# EAGLE design TamaDroppy (EAGLE 9.6.2)
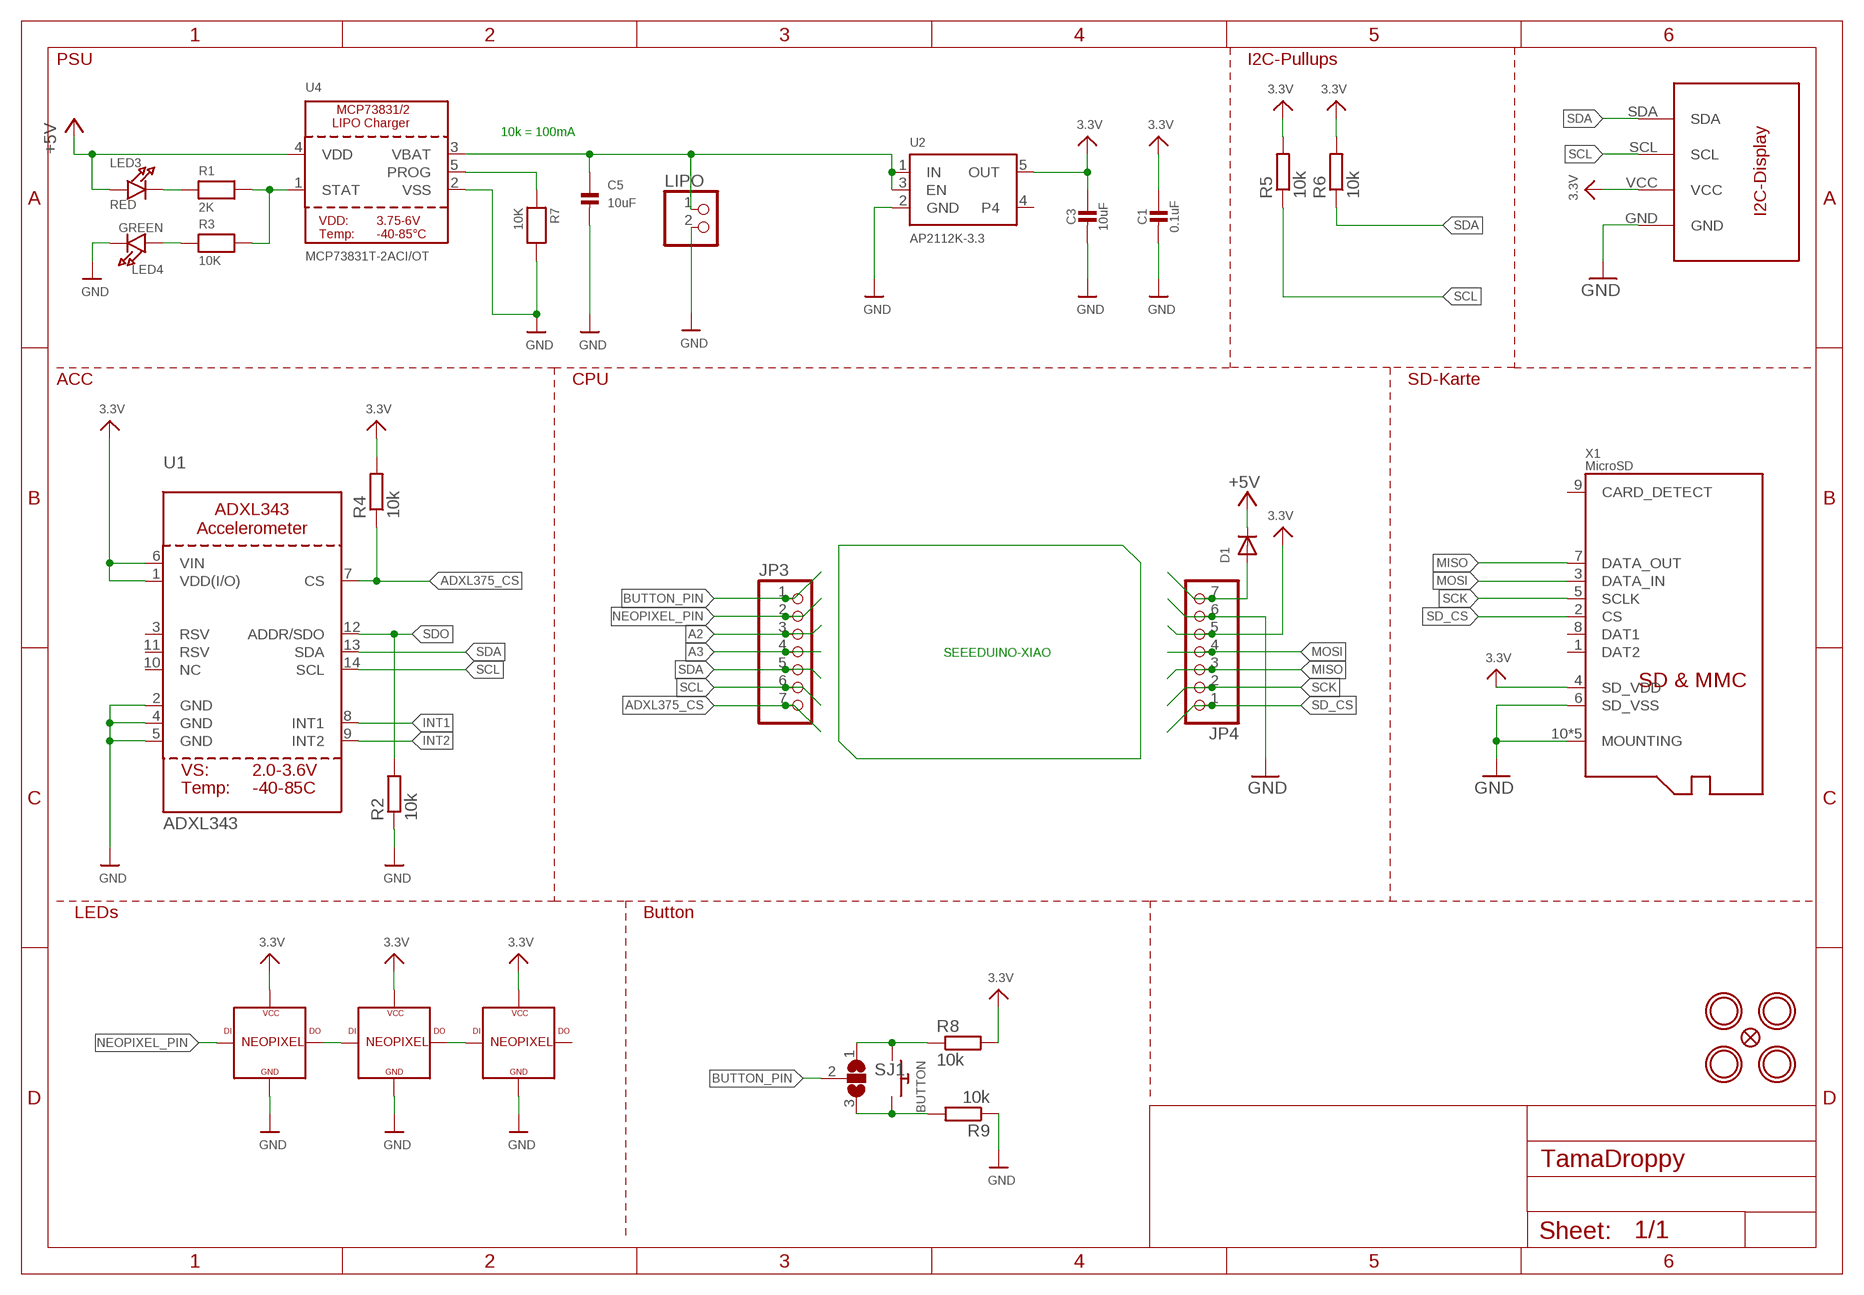
[diagram p0: schematic, sheet 1]

## Parts
BUTTON  SWITCH_PUSHBUTTONC&K_KSS  [BTN_CK_KSS]
C1  0.1uF  CAP_CERAMIC0603_NO  [0603-NO]
C3  10uF  CAP_CERAMIC0805-NOOUTLINE  [0805-NO]
C5  10uF  CAP_CERAMIC0805-NOOUTLINE  [0805-NO]
D1  DIODESOD-323F  [SOD-323F]
FID3  FIDUCIAL_1MM  [FIDUCIAL_1MM]
JP3  HEADER-1X7THICKER  [1X07_ROUND_76]
JP4  HEADER-1X7THICKER  [1X07_ROUND_76]
LED3  RED  LED0603_NOOUTLINE  [CHIPLED_0603_NOOUTLINE]
LED4  GREEN  LED0603_NOOUTLINE  [CHIPLED_0603_NOOUTLINE]
LIPO  PINHD-1X2  [1X02]
R1  2K  RESISTOR_0603_NOOUT  [0603-NO]
R2  10k  R-EU_M0805  [M0805]
R3  10K  RESISTOR_0603_NOOUT  [0603-NO]
R4  10k  R-EU_M0805  [M0805]
R5  10k  R-EU_M0805  [M0805]
R6  10k  R-EU_M0805  [M0805]
R7  10K  RESISTOR_0603_NOOUT  [0603-NO]
R8  10k  R-EU_M0805  [M0805]
R9  10k  R-EU_M0805  [M0805]
SJ1  SJ2W  [SJ_2]
U1  ADXL343  ACCEL_ADXL343  [LGA14]
U2  AP2112K-3.3  VREG_SOT23-5  [SOT23-5]
U4  MCP73831T-2ACI/OT  MCP73831/2  [SOT23-5]
U$2  MOUNTINGHOLE2.5  [MOUNTINGHOLE_2.5_PLATED]
U$16  EASTRISING_0.66  [EASTRISING_0.66]
U$17  MOUNTINGHOLE2.5  [MOUNTINGHOLE_2.5_PLATED]
U$19  MOUNTINGHOLE2.5  [MOUNTINGHOLE_2.5_PLATED]
U$21  MOUNTINGHOLE2.5  [MOUNTINGHOLE_2.5_PLATED]
U$31  WS2812_BOB  [WS2812B]
U$32  WS2812_BOB  [WS2812B]
U$33  WS2812_BOB  [WS2812B]
X1  MicroSD  MICROSD104031-0811  [MOLEX_104031-0811]

## Nets
3.3V [lowpower]: C1.1 C3.1 JP4.5 R4.2 R5.2 R6.2 R8.2 U1.1(VDD(I/O)) U1.6(VIN) U2.5(OUT) U$16.VCC U$31.VCC1(VCC) U$31.VCC2(VCC) U$32.VCC1(VCC) U$32.VCC2(VCC) U$33.VCC1(VCC) U$33.VCC2(VCC) X1.4(SD_VDD)
+5V [power]: D1.C LED3.A U4.4(VDD)
A2: JP3.3
A3: JP3.4
ADXL375_CS: JP3.7 R4.1 U1.7(CS)
BUTTON_PIN: JP3.1 SJ1.2
GND [power]: C1.2 C3.2 C5.2 JP4.6 LED4.C LIPO.2 R2.1 R7.2 R9.1 U1.2(GND) U1.4(GND) U1.5(GND) U2.2(GND) U4.2(VSS) U$16.GND U$31.GND1(GND) U$31.GND2(GND) U$32.GND1(GND) U$32.GND2(GND) U$33.GND1(GND) U$33.GND2(GND) X1.6(SD_VSS) X1.10(MOUNTING) X1.G1(MOUNTING) X1.G2(MOUNTING) X1.G3(MOUNTING) X1.G4(MOUNTING)
INT1: U1.8(INT1)
INT2: U1.9(INT2)
MISO: JP4.3 X1.7(DATA_OUT)
MOSI: JP4.4 X1.3(DATA_IN)
N$2: LED3.C R1.1
N$3: R1.2 R3.2 U4.1(STAT)
N$4: R7.1 U4.5(PROG)
N$5: D1.A JP4.7
N$6: LED4.A R3.1
N$7: BUTTON.P$1 R8.1 SJ1.1
N$8: BUTTON.P$2 R9.2 SJ1.3
N$9: U$31.DOUT(DO) U$32.DIN(DI)
N$10: U$32.DOUT(DO) U$33.DIN(DI)
NEOPIXEL_PIN: JP3.2 U$31.DIN(DI)
SCK: JP4.2 X1.5(SCLK)
SCL: JP3.6 R5.1 U1.14(SCL) U$16.SCL
SD_CS: JP4.1 X1.2(CS)
SDA: JP3.5 R6.1 U1.13(SDA) U$16.SDA
SDO: R2.2 U1.12(ADDR/SDO)
VBAT1: C5.1 LIPO.1 U2.1(IN) U2.3(EN) U4.3(VBAT)
Unconnected: U1.3(RSV) U1.10(NC) U1.11(RSV) U2.4 U$33.DOUT(DO) X1.1(DAT2) X1.8(DAT1) X1.9(CARD_DETECT)

## Notes on the sheet
- PSU | I2C-Pullups
- 10k = 100mA
- ACC | CPU | SD-Karte
- SEEEDUINO-XIAO
- LEDs | Button

## Library data of the parts
BUTTON = adafruit:SWITCH_PUSHBUTTON: Buttons SOFTTOUCHSMD_SJ - Soft touch temporary push button (Super Junk Akihabara) Compatible with SKPMANE010 [Mouser: 688-SKPMAN] C&K_KSS = Digikey: KSS221GLFS
C1 C3 C5 = microbuilder:CAP_CERAMIC: Ceramic Capacitors For new designs, use the packages preceded by an '_' character since they are more reliable: The following footprints should be used on most boards: _0402 - Standard footprint for regular board layouts _0603 - Standard footprint for regular board layouts _0805 - Standard footprint for regular board layouts _1206 - Standard footprint for regular board layouts For extremely tight-pitch boards where space is at a premium, the following 'micro-pitch' footprints can be used (smaller pads, no silkscreen outline, etc.): _0402MP - Micro-pitch footprint for very dense/compact boards _0603MP - Micro-pitch footprint for very dense/compact boards _0805MP - Micro-pitch footprint for very dense/compact boards _1206MP - Micro-pitch footprint for very dense/compact boards
D1 = adafruit:DIODE: Diode SMADIODE - SMA Surface Mount Package 20V 1A Schottky Diode Digikey: 641-1014-6-ND DO-1N4148 - Through Hole Small Current Diode SOD-123 20V 1 A (.5mV Vf) Schottky Diode - Digikey: MBRX120TPMSCT-ND SOD-323 10V 570mA (.38mV Vf, 3ns) Schottky Diode - Digikey: ZLLS410CT-ND SOD-523 30V 30mA Schottky Diode (RB751S-40TE61) - Digikey: RB751S-40TE61CT-ND SOT23-R/W - SOT23 Package (R = Solder Paste/Reflow Ovens, W = Hand-Soldering) BAT54Film 40V 300mA - Digikey: 497-7162-1-ND
FID3 = microbuilder:FIDUCIAL: Fiducial Alignment Points Various fiducial points for machine vision alignment.; BOM: EXCLUDE
JP3 JP4 = adafruit_electromech:HEADER-1X7: PIN HEADER
LED3 LED4 = microbuilder:LED: LED 0603 - 0603 Surface Mount Package 2mA: Green LED - Low Power (3.9mcd, 2ma, 1.7Vf) - Digikey: 475-2709-2-ND Orange LED - Low Power (9.8mcd, 2ma, 1.8Vf) - Digikey: 475-1194-2-ND Red LED - Low Power (5mcd, 2ma, 1.8Vf) - Digikey: 475-1195-2-ND Yellow LED - Low Power (7mcd, 2ma, 1.8Vf) - Digikey: 475-1196-2-ND 5mA: Blue LED - Low Power (17mcd, 5ma, 2.9Vf) - Digikey: LNJ937W8CRACT-ND 0805 - 0805 Surface Mount Package 2mA: Red LED (8.8mcd, 2mA, 1.8Vf, Clear) - Low Power [Digikey: 475-2510-1-ND] Green LED (5mcd, 2mA, 1.8Vf, Clear) - Low Power [Digikey: 475-2730-1-ND] Yellow LED (11.3mcd, 2mA, 1.8Vf, Clear) - Low Power [Digikey: 475-2555-1-ND] 20mA: Red LED (104mcd, 20mA, Diffused) - LS R976 [Digikey: 475-1278-6-ND] Red LED (12mcd, 20mA, 2.0Vf, Clear) - APT2012EC [Digikey: 754-1128-1-ND] Green LED (15mcd, 20mA, 2.2Vf, Clear) - APT2012GC [Digikey: 754-1131-1-ND] Orange LED (160mcd, 20mA, 2.1Vf, Clear) - APT2012SECK [Digikey: 754-1130-1-ND] 1206 - 1206 Surface Mount Package Green LED (26mcd, 20mA, Diffused) - LG N971 [Digikey: 475-1407-6-ND] Red LED (15mcd, 20mA, Diffused) - LH N974 [Digikey: 475-1416-6-ND] Cree - Cree High-Power Surface Mount LEDs XPEBWT-L1-0000-00D50 - White 111lm 350mA 2.9Vf 6200K 110° XTEAWT-00-0000-00000LEE3 - White 114lm 350mA 2.85Vf 5000K 115° Everlight - Everlight 45-21 Series Surface Mount LEDs 45-21/QK2C-B2832AC2CB2/2T - Warm White 2000mcd 20mA 3.25Vf 3050K 120° 45-21/LK2C-B38452C4CB2/2T - Nuetral White 2000mcd 20mA 3.25Vf 4150K 120° 45-21/LK2C-B50634C6CB2/2T - Cold White 2200mcd 20mA 3.25Vf 5650K 120° PLCC2 Reverse Mount LS T77K-J1L2-1-0-2-R18-Z - Red 11.25mcd 2mA 1.8Vf 630nm 120° LO T77K-L1M2-24-Z - Orange 19.6mcd 2mA 1.8Vf 606nm 120° LY T77K-K2M1-26-Z - Yellow 15.7mcd 2mA 1.8Vf 587nm 120°; JLC_ROTATION: 270
LIPO = pinhead:PINHD-1X2: PIN HEADER
R1 R3 R7 = microbuilder:RESISTOR: Resistors For new designs, use the packages preceded by an '_' character since they are more reliable: The following footprints should be used on most boards: _0402 - Standard footprint for regular board layouts _0603 - Standard footprint for regular board layouts _0805 - Standard footprint for regular board layouts _1206 - Standard footprint for regular board layouts For extremely tight-pitch boards where space is at a premium, the following 'micro-pitch' footprints can be used (smaller pads, no silkscreen outline, etc.): _0402MP - Micro-pitch footprint for very dense/compact boards _0603MP - Micro-pitch footprint for very dense/compact boards _0805MP - Micro-pitch footprint for very dense/compact boards _1206MP - Micro-pitch footprint for very dense/compact boards
R2 R4-R6 R8 R9 = rcl:R-EU_: RESISTOR, European symbol; SPICEPREFIX: R
SJ1 = jumper:SJ2W: SMD solder JUMPER
U1 = microbuilder:ACCEL_ADXL343: ADXL343 - Digital Accelerometer 2/4/8/16g
U2 = adafruit_power:VREG_SOT23-5: SOT23-5 Fixed Voltage Regulators Part Current Out V Out V In V Dropout θJA (°C/W) TJ (°C) Digikey Part No. ADP121 150mA 3.3V 3.4-5.5V 0.09V @ 150mA -- -- ADP121-AUJZ33R7CT-ND ADP121 150mA 3.0V 3.1-5.5V 0.09V @ 150mA -- -- ADP121-AUJZ30R7CT-ND ADP122 300mA 3.3V 3.4-5.5V 0.085V @ 300mA -- -- ADP122AUJZ-3.3-R7CT-ND ADP1712 300mA 3.3V 3.5-5.5V 0.17V @ 300mA -- -- ADP1712AUJZ-3.3-R7TR-ND AP7311 (Low Cost) 150mA 3.3V 3.5-6V 0.15V @ 150mA -- -- AP7311-33WG-7DICT-ND LD39015M18R 150mA 1.8V 1.9V-5.5V 0.08V @ 100mA -- -- 497-6977-1-ND LP2985A-33DBVR 150mA 3.3V 3.3-16V 0.28V @ 150mA 206 150 296-18479-1-ND MCP1824T-3302E/OT 300mA 3.3V 3.5V-6V 0.2V @ 300mA -- -- MCP1824T-3302E/OTCT-ND MIC5205-2.5YM5 TR 150mA 2.5V 2.7-16V 0.165V @ 150mA -- -- 576-1257-2-ND MIC5205-3.0YM5 TR 150mA 3.0V 3.2V-16V 0.165V @ 150mA -- -- 576-1258-2-ND MIC5205-3.3YM5 TR 150mA 3.3V 3.5V-16V 0.165V @ 150mA -- -- 576-1259-2-ND TPS780330220 150mA 3.3V+2.2V 3.6-5.5V 250mV Max -- -- 296-23332-1-ND TDA3663/N1,135 100mA 3.3V 3.5-45V 0.18V @ 50mA -- -- 568-5343-1-ND Max operating temp can be calculated using θJA, TJ (max junction temperature), and power in watts. Set the "Maximum Ambient Temperature" until it reaches TJ ("Max Junction Temperature"), which is the absolute limit for safe use of the regulator: Heat Sink Temperature Calculator <http://www.daycounter.com/Calculators/Heat-Sink-Temperature-Calculator.phtml> For example, With 12V source into a 3.3V LP2985 and a 30mA load, we are dissipating (12V-3.3V) * 0.03A = 0.261W. With a θJA of 206 °C/W, a TJ of 150°C, and 261mW we can safely use the chip without a heat sink up to 75°C (=147.1°C Junction Temperature).
U4 = microbuilder:MCP73831/2: MCP73831/2 LIPO Charger VDD: 3.75 - 6V Temp -40 - 85°C Programmable Charge Rate: 15-500mA NOTE: STAT is a tri-state logic output on the MCP73831 and an open-drain output on the MCP73832. SOT23-5 with 4.2V output and tri-state logic on STAT = MCP73831T-2ACI/OT; JLC_ROTATION: 270; LCSC: C424093
U$2 U$17 U$19 U$21 = adafruit_electromech:MOUNTINGHOLE: Mounting Hole For #2 screws (0.086"/2.18mm width, 0.094"/2.4mm hole) use 2.5mm; BOM: EXCLUDE
U$16 = Erics-Sachen:EASTRISING_0.66
U$31-U$33 = Erics-Sachen:WS2812_BOB
X1 = adafruit_electromech:MICROSD: MicroSD/Transflash Card Holder with SPI pinout 3M: 2908-05WB-MG 4UConnector: 19656 Footprint courtesy: Adafruit Industries

## Net classes
1 power: width 0.305 mm
2 lowpower: width 0.254 mm, drill 0.483 mm

## Board
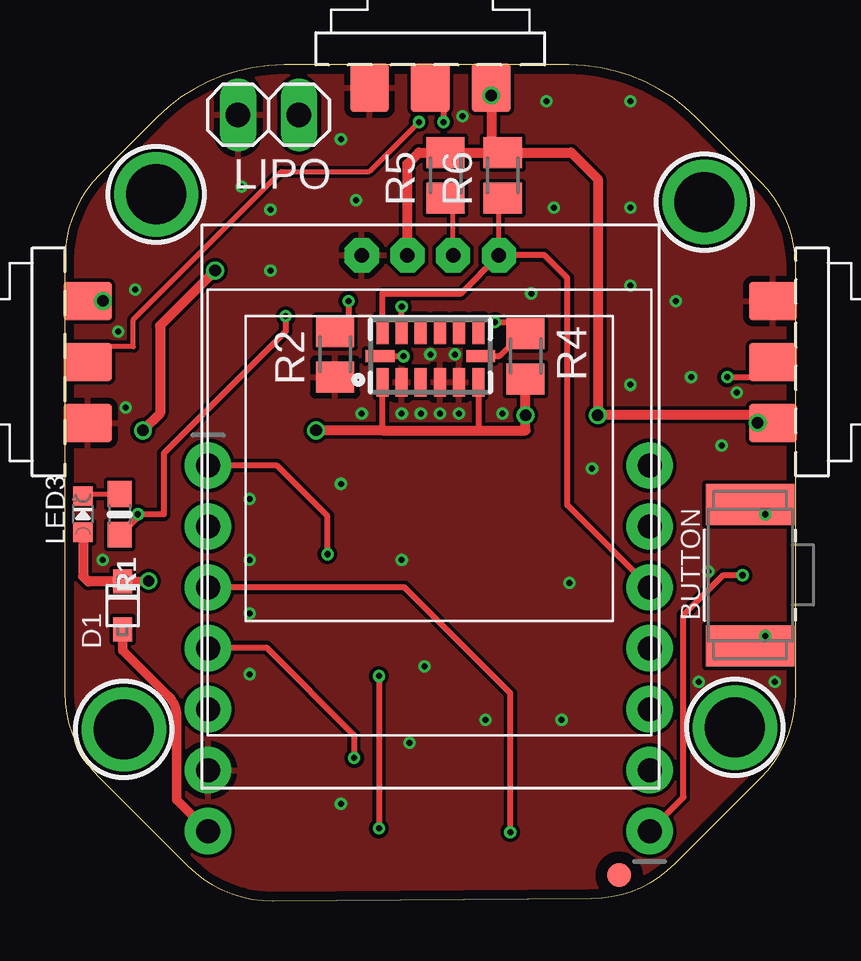
[diagram p1: board, top side]
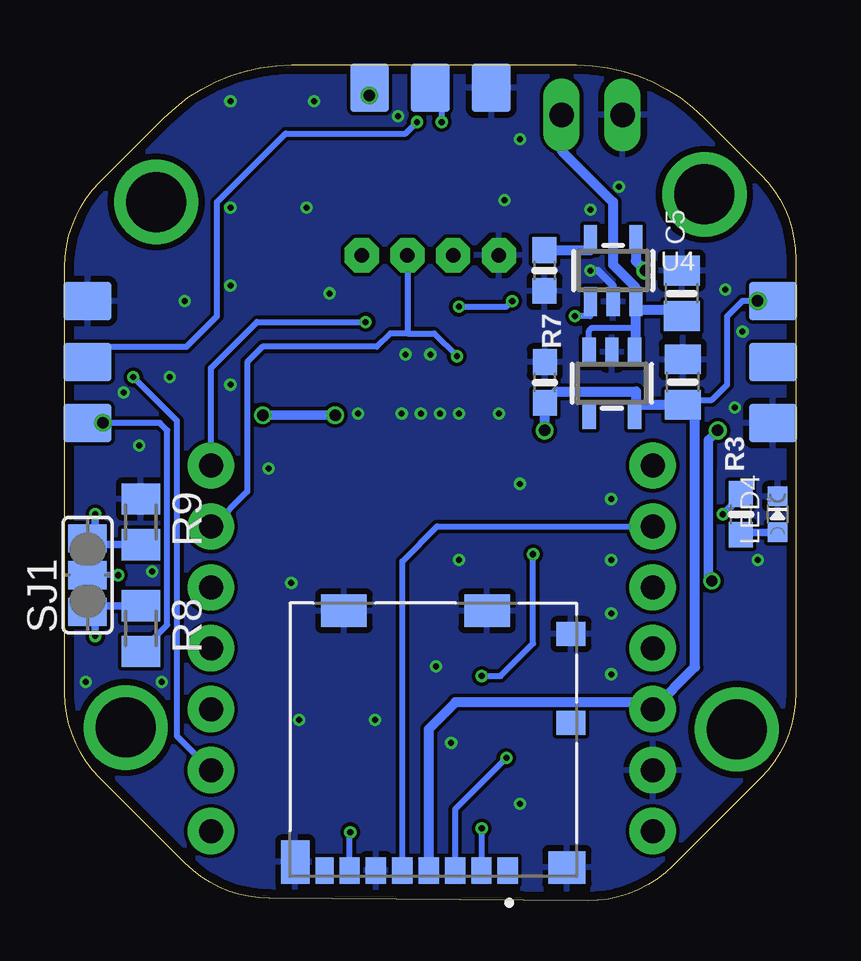
[diagram p2: board, bottom side, seen from below]

Size 30.48 x 34.85 mm. Coordinates in mm from the lower left corner, seen from the top.
Outline: 8.7,0 21.95,0.1 arc45 25.45,1.56 29.02,5.12 arc45 30.48,8.66 30.48,26.42 arc45 29.02,29.96 26.33,32.65 arc45 21.02,34.85 9.14,34.85 arc45 3.84,32.65 1.46,30.28 arc45 0,26.74 0,8.66 arc45 1.46,5.12 5.12,1.46 arc45 8.7,0
Copper layers (1*16): Top 0.035559375mm / dielectric 1.6mm / Bottom 0.035559375mm
Design rules "oshpark-2layer": minimum track width 6mil, minimum drill 10mil, track to track 6mil, track to pad 6mil, pad to pad 6mil, via to via 6mil, smd to smd 6mil, copper to edge 15mil, drill to drill 6mil, minimum pad ring 5mil, minimum via ring 5mil, stop-mask expansion 2.5mil, vias tented up to drill 0mil, thermal gap 10mil

### Footprints (pad centres in the part's own frame; a part is rotated, then mirrored left to right if it is on the bottom)
BTN_CK_KSS = smd 1.7 x 3.7: P$1 -2.95,0; P$2 2.95,0
0603-NO = smd 1.075 x 1: 1 -0.85,0; 2 0.85,0
0805-NO = smd 1.24 x 1.5: 1 -0.95,0; 2 0.95,0
SOD-323F = smd 1 x 0.8: A -1,0; C 1,0
FIDUCIAL_1MM = smd 1 x 1: 1 0,0
1X07_ROUND_76 = drill 1 pad 1.93: 1 -7.62,0; 2 -5.08,0; 3 -2.54,0; 4 0,0; 5 2.54,0; 6 5.08,0; 7 7.62,0
CHIPLED_0603_NOOUTLINE = smd 0.8 x 0.8: A 0,-0.75; C 0,0.75
1X02 = drill 1.016 long: 1 -1.27,0; 2 1.27,0
M0805 = smd 1.3 x 1.6: 1 -0.95,0; 2 0.95,0
SJ_2 = smd 1.168 x 1.6: 1 -1.524,0; 2 0,0; 3 1.524,0
LGA14 = smd 0.5 x 1.2: 1 2,1.1; 2 1.2,1.1; 3 0.4,1.1; 4 -0.4,1.1; 5 -1.2,1.1; 6 -2,1.1; 8 -2,-1.1; 9 -1.2,-1.1; 10 -0.4,-1.1; 11 0.4,-1.1; 12 1.2,-1.1; 13 2,-1.1 | smd 1.2 x 0.5: 7 -2.1,0; 14 2.1,0
SOT23-5 = smd 0.55 x 1.2: 1 -0.95,-1.3; 2 0,-1.3; 3 0.95,-1.3; 4 0.95,1.3; 5 -0.95,1.3
MOUNTINGHOLE_2.5_PLATED = drill 2.5 pad 3.2: P$1 0,0
EASTRISING_0.66 = drill 0.6 pad 1.422 octagon: GND -2.857,6.985; SCL 0.953,6.985; SDA 2.857,6.985; VCC -0.953,6.985
WS2812B = smd 1.6 x 2: DIN 0,-0.953; GND1 -2.54,-0.953; VCC1 2.54,-0.953 | smd 1.6 x 2 bottom: DOUT 0,-0.953; GND2 -2.54,-0.953; VCC2 2.54,-0.953
MOLEX_104031-0811 = smd 0.85 x 1.1: 1 3.105,-5.45; 2 2.005,-5.45; 3 0.905,-5.45; 4 -0.195,-5.45; 5 -1.295,-5.45; 6 -2.395,-5.45; 7 -3.495,-5.45 | smd 0.75 x 1.1: 8 -4.545,-5.45 | smd 1.2 x 1: 9 5.74,0.7; 10 5.74,4.4 | smd 1.55 x 1.35: G1 5.565,-5.325 | smd 1.17 x 1.8: G2 -5.755,-5.1 | smd 1.9 x 1.35: G3 -3.73,5.375; G4 2.24,5.375

### Placement (x,y rotation side)
BUTTON  28.57,13.57 90 top
C1  10.46,21.61 90 bottom
C3  4.71,21.62 90 bottom
C5  4.76,25.32 90 bottom
D1  2.41,12.3 90 top
FID3  23.11,1.06 0 top
JP3  24.38,10.53 90 top
JP4  5.97,10.53 270 top
LED3  0.76,16.11 0 top
LED4  0.76,16.11 0 bottom
LIPO  8.49,32.77 180 top
R1  2.29,16.11 270 top
R2  11.27,22.78 90 top
R3  2.29,16.11 90 bottom
R4  19.21,22.7 270 top
R5  15.88,30.24 90 top
R6  18.26,30.24 90 top
R7  10.48,26.27 270 bottom
R8  27.3,11.35 270 bottom
R9  27.3,15.8 270 bottom
SJ1  29.53,13.57 90 bottom
U1  15.24,22.72 180 top
U2  7.67,21.57 180 bottom
U4  7.62,26.27 0 bottom
U$2  3.81,29.45 0 top
U$16  15.24,19.92 0 top
U$17  26.67,29.13 0 top
U$19  2.46,7.14 0 top
U$21  27.94,7.22 0 top
U$31  30.48,22.46 270 top
U$32  15.24,34.85 0 top
U$33  0,22.46 90 top
X1  15.11,6.72 0 bottom

### Tracks (layer width: path | path; a pad name or v marks a point on that pad's centre or on a via)
3.3V  (via drill 0.48)
  Top 0.254: 13.24,19.61 U1.1 | U1.6 17.24,19.61 | U$32.VCC1 v17.78,33.58 | v28.89,19.92 28.89,20.24 | U$33.VCC1 v1.59,25
  Top 0.406: v10.48,19.61 13.24,19.61 17.24,19.61 19.21,19.61 v19.21,20.24 R4.2 | U$16.VCC 14.29,30.72 14.76,31.19 R5.2 17.94,31.19 | 17.94,31.19 R6.2 21.12,31.19 22.23,30.08 v22.23,20.24 28.89,20.24 29.21,19.92 U$31.VCC1 | U$32.VCC1 17.78,31.35 17.94,31.19
  Bottom 0.254: C1.1 10.48,20.76 | v17.78,33.58 U$32.VCC1 | C3.1 4.51,20.88 3.49,20.88 2.86,21.51 2.86,24.37 2.22,25 v1.59,25 U$33.VCC1 | v28.89,19.92 U$31.VCC1 26.52,19.92 26.2,19.61 26.2,11.5 R8.2
  Bottom 0.39: v22.23,20.24 v19.21,20.24
  Bottom 0.406: C1.1 9.99,21.23 6.67,21.23 6.67,20.27 U2.5 6.72,20.67 C3.1 4.21,20.16 4.21,9.75 JP4.5 6.12,7.99 6.4,8.27 14.19,8.27 15.31,7.16 X1.4 | 10.48,20.76 v10.48,19.61
+5V  (via drill 0.45, 0.48)
  Top 0.39: v3.5,13.34 3.47,13.3 D1.C
  Top 0.406: LED3.A 0.76,13.53 0.98,13.3 D1.C | v3.25,19.61 3.97,20.32 3.97,23.97 v6.27,26.27
  Bottom 0.39: 3.65,18.02 3.65,13.49 v3.5,13.34
  Bottom 0.4: v3.25,19.61 3.65,19.21 3.65,18.02
  Bottom 0.406: U4.4 6.67,26.67 v6.27,26.27
ADXL375_CS  (via drill 0.25)
  Top 0.254: U1.7 18.11,22.72 19.05,23.65 | 19.05,23.65 R4.1 | v17.94,24.13 18.57,24.13 19.05,23.65
  Top 0.305: 17.36,22.7 U1.7
  Bottom 0.254: JP3.7 24.38,22.21 22.46,24.13 v17.94,24.13
BUTTON_PIN  (via drill 0.25)
  Top 0.254: JP3.1 25.8,4.32 25.8,11.91 27.46,13.57 v28.26,13.57
  Bottom 0.254: v28.26,13.57 SJ1.2
GND  (via drill 0.25)
  Bottom 0.305: U4.2 7.62,25.64 8.26,26.27 v8.57,26.27
  other vias: 14.05,20.32 15.64,20.32 16.43,20.32 18.26,20.32 14.84,20.32 12.38,20.32 16.27,22.78 15.24,22.78 8.57,28.81 2.94,25.48 7.38,29.77 2.22,23.73 2.54,20.56 1.59,14.21 20.4,28.89 23.57,28.89 23.57,33.34 20.08,33.34 12.14,29.21 11.51,31.75 27.38,18.97 28.02,21.19 26.11,21.83 25.48,25 23.57,25.64 19.45,25.32 21.99,18.02 23.57,21.51 29.61,9.13 26.43,9.13 26.83,13.73 21.03,13.26 14.05,14.21 15,9.76 14.37,6.59 17.54,7.54 20.72,7.54 11.51,4.05 7.7,14.21 7.7,11.99 7.7,9.45 7.7,16.75 11.51,17.38 16.59,32.7
  pour Top: -1.27,38.97 33.02,38.97 33.02,-2.94 -1.27,-2.94
  pour Bottom: -2.54,37.39 -2.54,-1.35 36.51,-1.35 36.51,37.39
MISO  (via drill 0.25)
  Top 0.254: v18.57,2.86 18.57,8.65 14.16,13.07 JP4.3
  Bottom 0.254: X1.7 18.61,2.82 v18.57,2.86
MOSI  (via drill 0.25)
  Top 0.254: JP4.4 6,10.56 8.41,10.56 12.06,6.91 v12.06,5.95
  Bottom 0.254: v12.06,5.95 14.21,3.81 X1.3
N$2
  Top 0.2: LED3.C 0.76,16.96 R1.1
N$3  (via drill 0.25)
  Top 0.254: v9.21,24.37 9.21,23.73 4.13,18.65 4.13,16.11 v3.05,16.11
  Top 0.305: R1.2 3.05,16.03 v3.05,16.11
  Bottom 0.254: U4.1 8.57,24.37 v9.21,24.37
  Bottom 0.305: v3.05,16.11 2.29,16.88 R3.2
N$4
  Bottom 0.406: R7.1 8.57,27.12 U4.5
N$5
  Top 0.39: JP4.7 4.66,4.22 4.66,5.99 4.67,6 4.67,7.68 arc45 4.31,8.55 2.41,10.45 D1.A
N$6
  Bottom 0.305: LED4.A 2.29,15.36 R3.1
N$7  (via drill 0.25)
  Top 0.305: v29.21,11.03 28.8,10.62 BUTTON.P$1
  Bottom 0.305: v29.21,11.03 29.21,11.73 SJ1.1 29.28,12.3 R8.1
N$8  (via drill 0.25)
  Top 0.305: v29.21,16.11 28.8,16.52 BUTTON.P$2
  Bottom 0.305: v29.21,16.11 29.21,15.42 SJ1.3 29.29,14.86 27.32,14.86 R9.2
N$9  (via drill 0.25)
  Top 0.254: v15.8,32.46 15.8,33.89 U$32.DIN
  Bottom 0.254: U$31.DOUT 29.21,22.46 28.57,23.1 25.4,23.1 24.13,24.37 24.13,29.13 21.27,31.99 16.27,31.99 v15.8,32.46
N$10  (via drill 0.25)
  Top 0.203: U$33.DIN 1.59,23.1 2.86,23.1 2.86,24.23 9.03,30.4 12.7,30.4 v14.76,32.46
  Top 0.254: 1.27,23.1 0.95,22.78 U$33.DIN
  Bottom 0.254: U$32.DOUT 14.76,33.42 v14.76,32.46
NEOPIXEL_PIN  (via drill 0.25)
  Top 0.254: v27.62,21.83 29.53,21.83 U$31.DIN
  Bottom 0.254: JP3.2 25.8,6.86 25.8,20 v27.62,21.83
SCK
  Bottom 0.254: X1.5 16.41,14.15 14.95,15.61 JP4.2
SCL  (via drill 0.25)
  Top 0.203: U$16.SCL 16.19,28.97 R5.1
  Top 0.254: U1.14 14.11,22.72 v14.13,22.7
  Bottom 0.254: 16.19,23.65 15.08,23.65 v14.13,22.7 | U$16.SCL 16.19,23.65 | 16.19,23.65 16.91,23.65 17.46,23.1 22.23,23.1 22.87,22.45 22.87,17.05 24.32,15.61 JP3.6
SD_CS  (via drill 0.25)
  Top 0.254: v10.95,14.45 10.95,16.03 8.84,18.15 JP4.1 | v13.1,9.37 v13.1,3.02
  Bottom 0.254: v13.1,9.37 12.31,9.37 10.95,10.72 v10.95,14.45 | v13.1,3.02 13.1,1.28 X1.2
SDA
  Top 0.203: U$16.SDA 18.1,29.13 R6.1
  Top 0.254: U1.13 13.24,25.32 16.51,25.32 U$16.SDA 20,26.91 20.95,25.96 20.95,16.49 JP3.5
SDO  (via drill 0.25)
  Top 0.254: U1.12 v14.04,24.76 v14.05,24.77 | v11.83,25 11.83,24.29 R2.2
  Bottom 0.254: v14.05,24.77 12.06,24.77 v11.83,25
VBAT1
  Bottom 0.254: U2.3 8.62,23.77 8.49,23.89 6.67,23.89
  Bottom 0.406: U4.3 6.67,23.89 6.67,22.87 U2.1 | U4.3 6.67,24.66 4.76,24.66 C5.1 | U4.3 6.67,25.56 7.62,26.51 7.62,29.13 9.76,31.27 LIPO.1